# EAGLE schematic Default Layout (EAGLE 8.5.0)
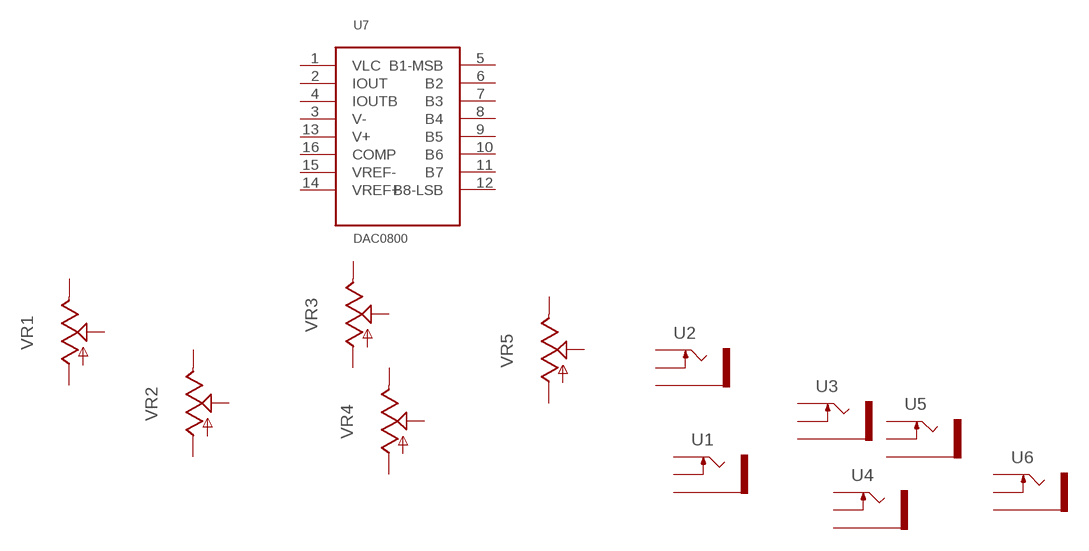
[diagram p0: schematic, sheet 1]

## Parts
U1  THONKICONNNEW  [WQP-PJ301M-12_JACK]
U2  THONKICONNNEW  [WQP-PJ301M-12_JACK]
U3  THONKICONNNEW  [WQP-PJ301M-12_JACK]
U4  THONKICONNNEW  [WQP-PJ301M-12_JACK]
U5  THONKICONNNEW  [WQP-PJ301M-12_JACK]
U6  THONKICONNNEW  [WQP-PJ301M-12_JACK]
U7  DAC0800  [DIL16]
VR1  9MM_SNAP-IN_POT_  [9MM_SNAP-IN_POT]
VR2  9MM_SNAP-IN_POT_  [9MM_SNAP-IN_POT]
VR3  9MM_SNAP-IN_POT_  [9MM_SNAP-IN_POT]
VR4  9MM_SNAP-IN_POT_  [9MM_SNAP-IN_POT]
VR5  9MM_SNAP-IN_POT_  [9MM_SNAP-IN_POT]
Unconnected: U1.P$1_TIP(TIP) U1.P$2_SWITCH(SWITCH) U1.P$3_SLEEVE(SLEEVE) U2.P$1_TIP(TIP) U2.P$2_SWITCH(SWITCH) U2.P$3_SLEEVE(SLEEVE) U3.P$1_TIP(TIP) U3.P$2_SWITCH(SWITCH) U3.P$3_SLEEVE(SLEEVE) U4.P$1_TIP(TIP) U4.P$2_SWITCH(SWITCH) U4.P$3_SLEEVE(SLEEVE) U5.P$1_TIP(TIP) U5.P$2_SWITCH(SWITCH) U5.P$3_SLEEVE(SLEEVE) U6.P$1_TIP(TIP) U6.P$2_SWITCH(SWITCH) U6.P$3_SLEEVE(SLEEVE) U7.1(VLC) U7.2(IOUT) U7.3(V-) U7.4(IOUTB) U7.5(B1-MSB) U7.6(B2) U7.7(B3) U7.8(B4) U7.9(B5) U7.10(B6) U7.11(B7) U7.12(B8-LSB) U7.13(V+) U7.14(VREF+) U7.15(VREF-) U7.16(COMP) VR1.1(A) VR1.2(S) VR1.3(E) VR2.1(A) VR2.2(S) VR2.3(E) VR3.1(A) VR3.2(S) VR3.3(E) VR4.1(A) VR4.2(S) VR4.3(E) VR5.1(A) VR5.2(S) VR5.3(E)

## Library data of the parts
U1-U6 = MusicThingModular:THONKICONN: 3.5mm socket for Eurorack modular synths
U7 = MusicThingModular:DAC0800: 8 Bit Parallel DAC
VR1-VR5 = MusicThingModular:9MM_SNAP-IN_POT: 9mm vertical snap-in pot, Alpha / Panasonic style